# Altium project chip_library.PrjPcb
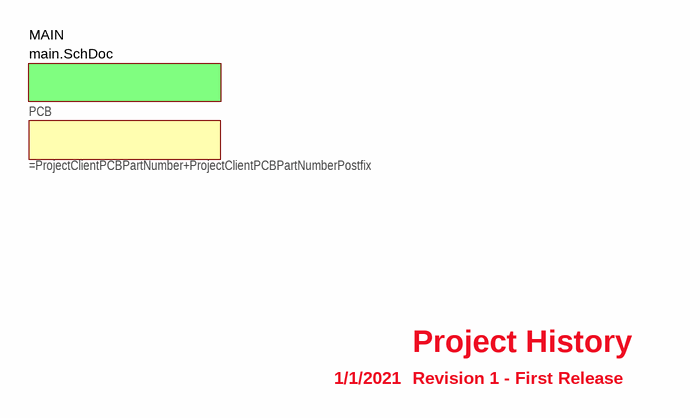
[diagram p0: top.SchDoc]
ProjectClient: Client Name; ProjectClientAddress: City, State; ProjectClientDocumentPartNumber: 000-000000; ProjectClientPCBAPartNumber: 000-000000; ProjectClientPCBPartNumber: 000-000000; ProjectDescription: Project Description; ProjectDocumentPartNumber: 101-000001; ProjectDrawnBy: J. Brinton; ProjectDrawnByDate: 8/23/2022; ProjectEngineer: J. Brinton; ProjectEngineerDate: 8/23/2022; ProjectFirm: Amaya Tech, Inc.; ProjectFirmAddress: Concord, California; ProjectFirmContact: support@amaya.tech; ProjectManager: N/A; ProjectManagerDate: N/A; ProjectPCBARelease: 1; ProjectPCBARevision: 1; ProjectPCBRelease: 1; ProjectPCBRevision: 1; ProjectProject: Project Name; ProjectQualityBy: N/A; ProjectQualityByDate: N/A; ProjectReviewedBy: J. Brinton; ProjectReviewedByDate: 8/23/2022; ProjectSchematicRelease: 1; ProjectSchematicRevision: 1
1 sheet, 1 parts. Net scope: strictly hierarchical (ports join the sheet entries above them; power ports are local).
Board file: amaya.PcbDoc

## Sheet top.SchDoc: Top
size Letter; Revision: 1; SheetNumber: 1; SheetTotal: 2

### Parts
PCB  (no value)  (mechanical)

### Sub-sheets
MAIN = main.SchDoc (file not in this document): no entries

### Notes on the sheet
- 1/1/2021
- Revision 1 - First Release
- Project History
- Designed By:
- Designed For:
- Title
- Project
- Engineer:
- Drawn By:
- Reviewed By:
- Client Document Part Number:
- Client PCB Part Number:
- Client PCBA Part Number:

### Library data of the parts
PCB = PCB: Printed Circuit Board; Manufacturer: Client Name; Manufacturer P/N: =ProjectClientPCBPartNumber+ProjectClientPCBPartNumberPostfix

## Assembly variants
DEFAULT: all parts fitted